# EAGLE design digitiser (EAGLE 5.12)
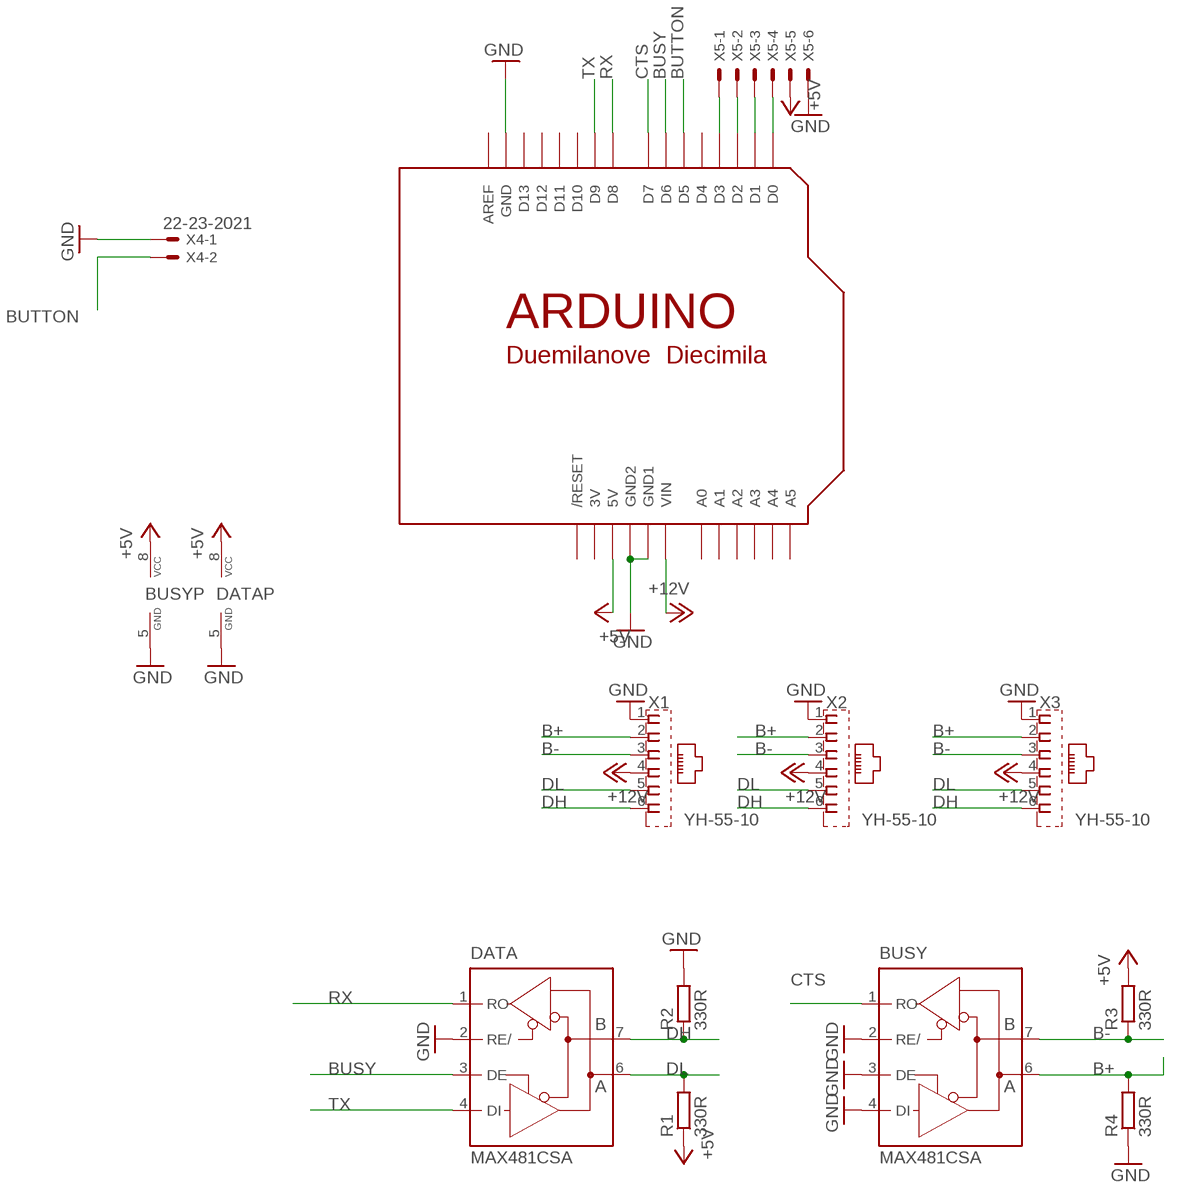
[diagram p0: schematic, sheet 1]

## Parts
BUSY  MAX481CSA  [SO08]
DATA  MAX481CSA  [SO08]
R1  330R  R-EU_0204/7  [0204/7]
R2  330R  R-EU_0204/7  [0204/7]
R3  330R  R-EU_0204/7  [0204/7]
R4  330R  R-EU_0204/7  [0204/7]
U$1  ARDUINO-NOHOLE  [ARDUINO-NOHOLE]
X1  YH-55-10  [YH-55-10]
X2  YH-55-10  [YH-55-10]
X3  YH-55-10  [YH-55-10]
X4  22-23-2021  [22-23-2021]
X5  22-23-2061  [22-23-2061]

## Nets
+5V: BUSY.8(VCC) DATA.8(VCC) R1.1 R3.2 U$1.5V X5.5
+12V: U$1.VIN X1.4 X2.4 X3.4
B+: BUSY.6(A) R4.2 X1.2 X2.2 X3.2
B-: BUSY.7(B) R3.1 X1.3 X2.3 X3.3
BUSY: DATA.3(DE) U$1.D6
BUTTON: U$1.D5 X4.2
CTS: BUSY.1(RO) U$1.D7
DH: DATA.7(B) R2.1 X1.6 X2.6 X3.6
DL: DATA.6(A) R1.2 X1.5 X2.5 X3.5
GND: BUSY.2(RE/) BUSY.3(DE) BUSY.4(DI) BUSY.5(GND) DATA.2(RE/) DATA.5(GND) R2.2 R4.1 U$1.GND U$1.GND1 U$1.GND2 X1.1 X2.1 X3.1 X4.1 X5.6
N$4: U$1.D3 X5.1
N$5: U$1.D2 X5.2
N$6: U$1.D1 X5.3
N$7: U$1.D0 X5.4
RX: DATA.1(RO) U$1.D8
TX: DATA.4(DI) U$1.D9
Unconnected: U$1.A0 U$1.A1 U$1.A2 U$1.A3 U$1.A4 U$1.A5 U$1.AREF U$1.D4 U$1.D10 U$1.D11 U$1.D12 U$1.D13 U$1.RESET(/RESET)

## Power pins joined to a net without a drawn wire
3V: U$1.3V

## Library data of the parts
BUSY DATA = maxim:MAX481CSA: RS485 TRANSEIVER; MF: MAXIM; MPN: MAX481CSA; OC_FARNELL: unknown; OC_NEWARK: 90C3817
R1-R4 = rcl:R-EU_: RESISTOR, European symbol
U$1 = adafruit:ARDUINO: Arduino Diecimila/Duemilanove Make a shield with ease, this package has all the named pins as well as the two mounting drill holes and an outline of the USB and DC power connector. The outline is on the DIMENSION layer, so if your board house uses it they will cut the outline to match. http://www.ladyada.net/library/pcb/eaglelibrary.html
X1-X3 = matt special:YH-55-10: RJ11 6 connects Source: YH-55-10.pdf; OC_FARNELL: unknown; OC_NEWARK: unknown
X4 = con-molex:22-23-2021: .100" (2.54mm) Center Header - 2 Pin; MF: MOLEX; MPN: 22-23-2021; OC_FARNELL: 1462926; OC_NEWARK: 25C3832
X5 = con-molex:22-23-2061: .100" (2.54mm) Center Header - 6 Pin; MF: MOLEX; MPN: 22-23-2061; OC_FARNELL: 1462922; OC_NEWARK: 27C1933

## Board
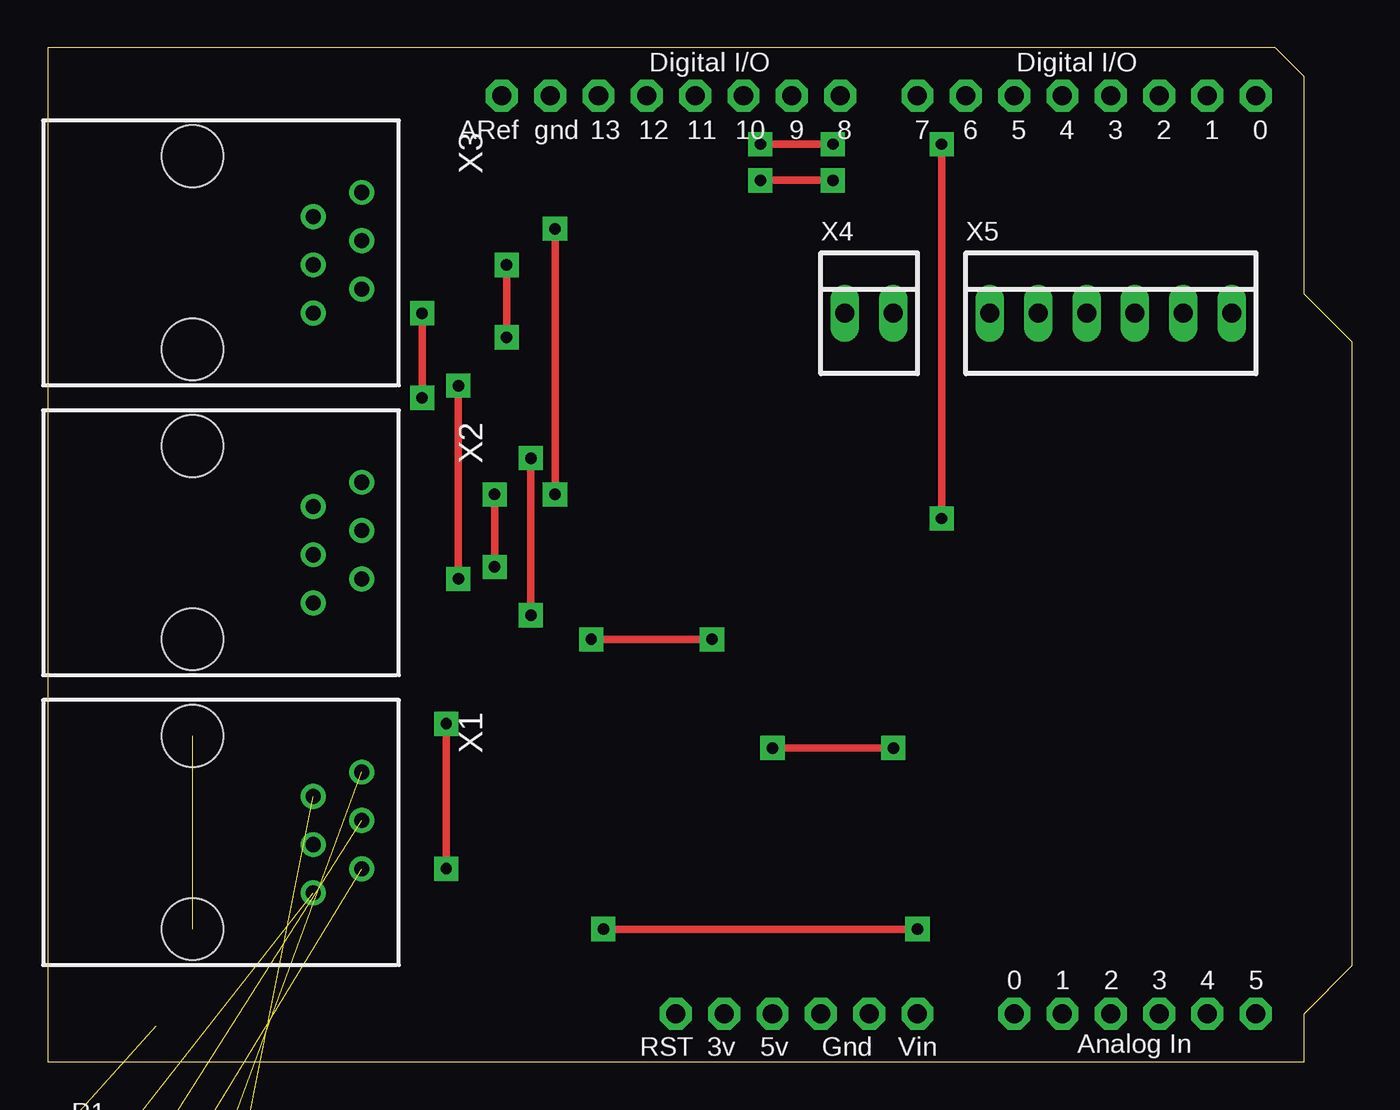
[diagram p1: board, top side]
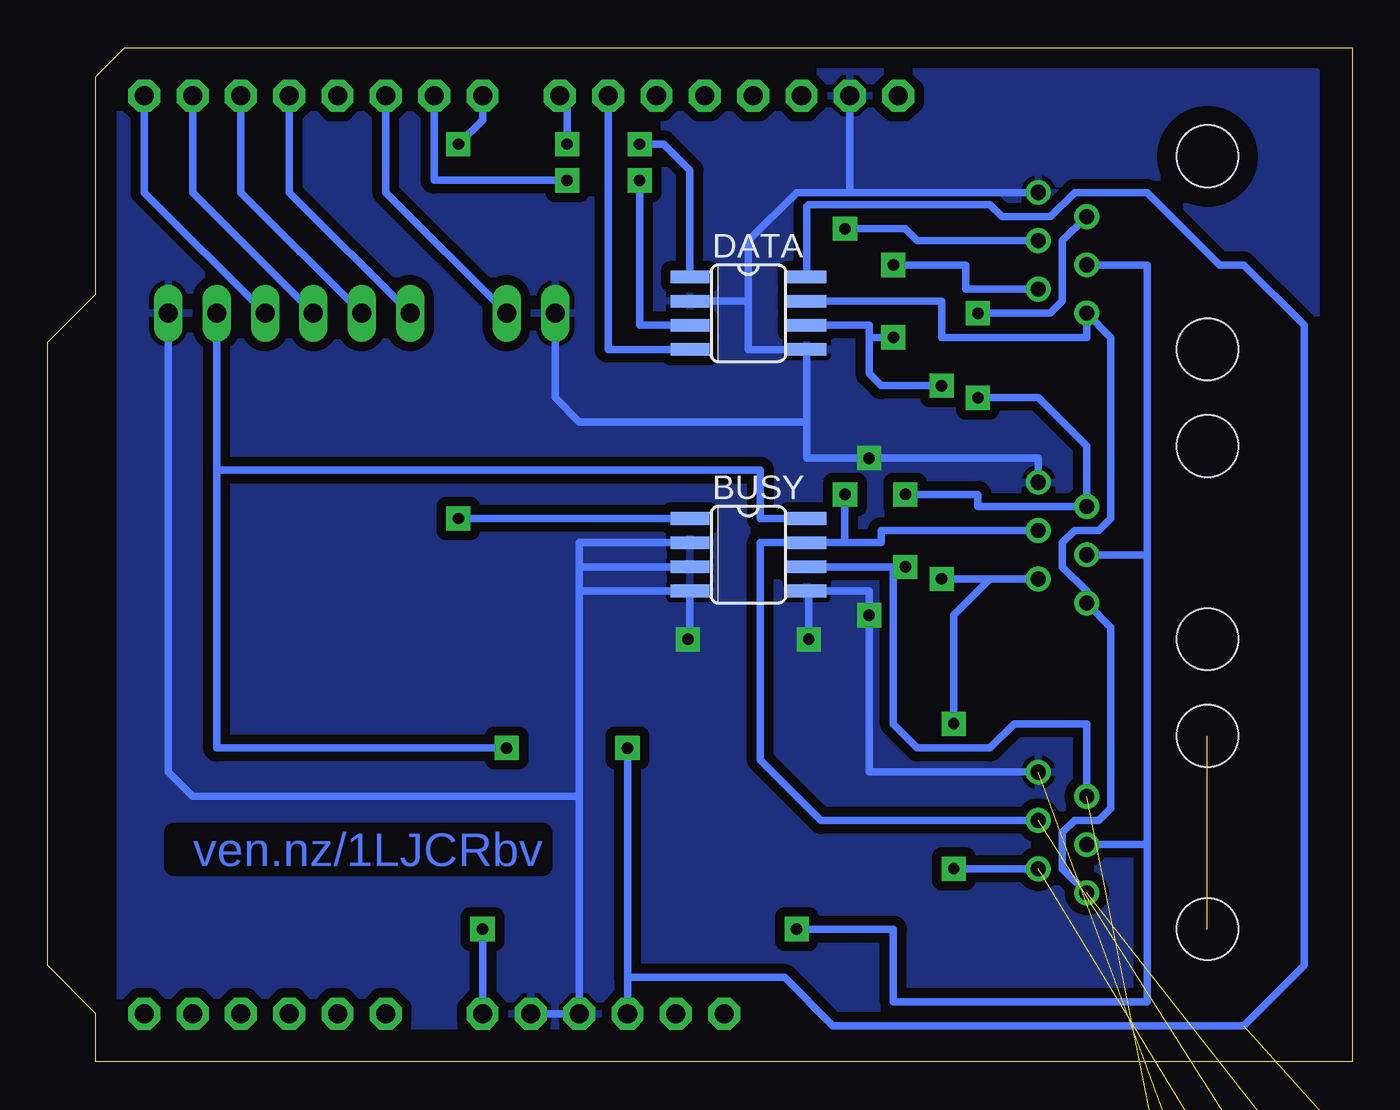
[diagram p2: board, bottom side, seen from below]

Size 68.58 x 53.34 mm. Coordinates in mm from the lower left corner, seen from the top.
Copper layers (1*16): Top 0.035mm / dielectric 1.5mm / Bottom 0.035mm
Design rules "default": minimum track width 10mil, minimum drill 24mil, track to track 8mil, track to pad 8mil, pad to pad 8mil, via to via 8mil, smd to smd 8mil, copper to edge 40mil, drill to drill 8mil, minimum pad ring 10mil, minimum via ring 8mil, stop-mask expansion 4mil, vias tented up to drill 0mil, thermal gap 10mil

### Footprints (pad centres in the part's own frame; a part is rotated, then mirrored left to right if it is on the bottom)
SO08 = smd 0.66 x 2.032: 1 -1.905,-3.073; 2 -0.635,-3.073; 3 0.635,-3.073; 4 1.905,-3.073; 5 1.905,3.073; 6 0.635,3.073; 7 -0.635,3.073; 8 -1.905,3.073
0204/7 = drill 0.813 octagon: 1 -3.81,0; 2 3.81,0
ARDUINO-NOHOLE = drill 1 pad 1.676 octagon: 3V 35.56,2.54; 5V 38.1,2.54; A0 50.8,2.54; A1 53.34,2.54; A2 55.88,2.54; A3 58.42,2.54; A4 60.96,2.54; A5 63.5,2.54; AREF 23.876,50.8; D0 63.5,50.8; D1 60.96,50.8; D2 58.42,50.8; D3 55.88,50.8; D4 53.34,50.8; D5 50.8,50.8; D6 48.26,50.8; D7 45.72,50.8; D8 41.656,50.8; D9 39.116,50.8; D10 36.576,50.8; D11 34.036,50.8; D12 31.496,50.8; D13 28.956,50.8; GND 26.416,50.8; GND1 43.18,2.54; GND2 40.64,2.54; RESET 33.02,2.54; VIN 45.72,2.54
YH-55-10 = drill 0.8 pad 1.3 round: 1 -2.54,5.08; 2 -1.27,2.54; 3 0,5.08; 4 1.27,2.54; 5 2.54,5.08; 6 3.81,2.54 | hole 3.25: -4.445,-3.81; 5.715,-3.81
22-23-2021 = drill 1 long: 1 -1.27,0; 2 1.27,0
22-23-2061 = drill 1 long: 1 -6.35,0; 2 -3.81,0; 3 -1.27,0; 4 1.27,0; 5 3.81,0; 6 6.35,0

### Placement (x,y rotation side)
BUSY  31.75,26.67 270 bottom
DATA  31.75,39.37 270 bottom
R1  3.81,-4.45 0 top  (outside the outline)
R2  3.81,-8.89 0 top  (outside the outline)
R3  3.81,-13.34 0 top  (outside the outline)
R4  3.81,-17.78 0 top  (outside the outline)
U$1  0,0 0 top
X1  11.43,12.7 270 top
X2  11.43,27.94 270 top
X3  11.43,43.18 270 top
X4  43.18,39.37 0 top
X5  55.88,39.37 0 top

### Tracks (layer width: path | path; a pad name or v marks a point on that pad's centre or on a via)
+5V  (via drill 0.6 pad 1.27)  (2 unrouted)
  Top 0.406: v38.1,16.51 v44.45,16.51
  Bottom 0.406: 38.1,4.45 U$1.5V | 38.1,4.45 v38.1,16.51 | v44.45,16.51 59.69,16.51 59.69,31.11 | 59.69,31.11 X5.5 | BUSY.8 31.11,28.57 31.11,31.11 59.69,31.11 | DATA.8 28.68,44.98 28.57,45.09 19.05,45.09 18.41,44.45 15.88,44.45 14.61,45.72 10.79,45.72 6.99,41.91 5.71,41.91 2.54,38.73 2.54,5.08 5.71,1.91 27.3,1.91 29.84,4.45 38.1,4.45
+12V  (via drill 0.6 pad 1.27)
  Top 0.406: v29.21,6.99 v45.72,6.99
  Bottom 0.406: v45.72,6.99 U$1.VIN | v29.21,6.99 24.13,6.99 24.13,3.17 10.79,3.17 10.79,11.43 | 10.79,11.43 X1.4 | 10.79,26.67 X2.4 | 10.79,11.43 10.79,26.67 | X3.4 10.79,41.91 10.79,26.67
B+  (via drill 0.6 pad 1.27)  (1 unrouted)
  Top 0.406: v23.5,26.04 v23.5,29.84 | v19.68,34.92 v19.68,39.37
  Bottom 0.406: 24.13,26.04 v23.5,26.04 | 24.13,26.04 BUSY.6 | v23.5,29.84 19.68,29.84 19.68,29.21 X2.2 13.97,32.38 16.51,34.92 v19.68,34.92 | X1.2 13.97,17.78 17.78,17.78 19.05,16.51 22.86,16.51 24.13,17.78 24.13,26.04 | X3.2 15.24,43.18 15.24,40.01 15.88,39.37 v19.68,39.37
B-  (via drill 0.6 pad 1.27)  (1 unrouted)
  Top 0.406: v26.67,29.84 v26.67,43.81
  Bottom 0.406: X2.3 24.77,27.94 24.77,27.3 26.67,27.3 | 26.67,27.3 BUSY.7 31.11,27.3 31.11,15.88 27.94,12.7 X1.3 | X3.3 22.86,43.18 23.5,43.81 v26.67,43.81 | 26.67,27.3 v26.67,29.84
BUSY  (via drill 0.6 pad 1.27)
  Top 0.406: v37.47,46.35 v41.27,46.35
  Bottom 0.406: DATA.3 37.47,38.73 v37.47,46.35 | v41.27,46.35 48.26,46.35 U$1.D6
BUTTON
  Bottom 0.406: U$1.D5 50.8,45.72 X4.2
CTS  (via drill 0.6 pad 1.27)
  Top 0.406: v46.99,28.57 v46.99,48.26
  Bottom 0.406: U$1.D7 45.72,49.53 v46.99,48.26 | BUSY.1 v46.99,28.57
DH  (1 unrouted)
  Bottom 0.406: DATA.7 21.59,40.01 21.59,38.1 13.97,38.1 X3.6 12.7,38.1 12.7,28.57 13.34,27.94 14.61,27.94 15.24,27.3 15.24,26.04 13.97,24.77 X2.6 12.7,22.86 12.7,13.34 13.34,12.7 14.61,12.7 15.24,12.06 15.24,10.16 X1.6
DL  (via drill 0.6 pad 1.27)  (1 unrouted)
  Top 0.406: v24.13,38.1 v24.13,41.91 | v21.59,25.4 v21.59,35.56 | v20.95,10.16 v20.95,17.78
  Bottom 0.406: X3.5 20.32,40.64 20.32,41.91 v24.13,41.91 | DATA.6 25.4,38.73 25.4,38.1 | 25.4,38.1 v24.13,38.1 | 19.05,25.4 X2.5 | 19.05,25.4 v21.59,25.4 | v21.59,35.56 24.77,35.56 25.4,36.2 25.4,38.1 | X1.5 v20.95,10.16 | v20.95,17.78 20.95,23.5 19.05,25.4
GND  (via drill 0.6 pad 1.27)  (2 unrouted)
  Top 0.406: v25.4,23.5 v25.4,31.75 | v28.57,22.23 v34.92,22.23
  Bottom 0.406: X2.1 16.51,31.75 v25.4,31.75 28.68,31.75 28.68,33.66 | 26.42,45.72 X3.1 | 26.42,45.72 U$1.GND | U$1.GND2 U$1.GND1 | U$1.GND2 40.01,2.54 | 40.64,24.77 40.64,13.97 | 40.64,13.97 U$1.GND2 | 40.64,24.77 BUSY.4 34.82,22.23 v34.92,22.23 | BUSY.2 40.64,27.3 40.64,26.04 | 40.64,26.04 BUSY.3 | 40.64,24.77 40.64,26.04 | X1.1 25.4,15.24 v25.4,23.5 25.4,24.77 BUSY.5 28.57,24.77 v28.57,22.23 | 31.75,40.01 DATA.2 | 31.75,40.01 31.75,37.47 DATA.5 28.68,33.66 | X4.1 41.91,34.92 40.64,33.66 28.68,33.66 | 26.42,45.72 29.21,45.72 31.75,43.18 31.75,40.01 | X5.6 62.23,15.24 60.96,13.97 40.64,13.97
  pour Bottom (isolate 0.508): 1.91,52.07 64.77,52.07 64.77,1.91 1.91,1.91
N$1  (via drill 0.6)
  other vias: 7.62,47.62
N$2  (via drill 0.6)
  other vias: 7.62,37.47
N$3  (via drill 0.6)
  other vias: 7.62,32.38
N$4
  Bottom 0.406: U$1.D3 55.88,45.72 X5.1
N$5
  Bottom 0.406: U$1.D2 58.42,45.72 X5.2
N$6
  Bottom 0.406: U$1.D1 60.96,45.72 X5.3
N$7
  Bottom 0.406: U$1.D0 63.5,45.72 X5.4
N$8  (via drill 0.6)
  other vias: 7.62,22.23
N$9  (via drill 0.6)  (1 unrouted)
  other vias: 7.62,17.14 7.62,6.99
RX  (via drill 0.6 pad 1.27)
  Top 0.406: v37.47,48.26 v41.27,48.26
  Bottom 0.406: DATA.1 34.82,46.89 36.2,48.26 v37.47,48.26 | v41.27,48.26 41.27,50.42 U$1.D8
TX
  Bottom 0.406: DATA.4 39.12,37.47 U$1.D9

### Text on the board
Bottom: ven.nz/1LJCRbv